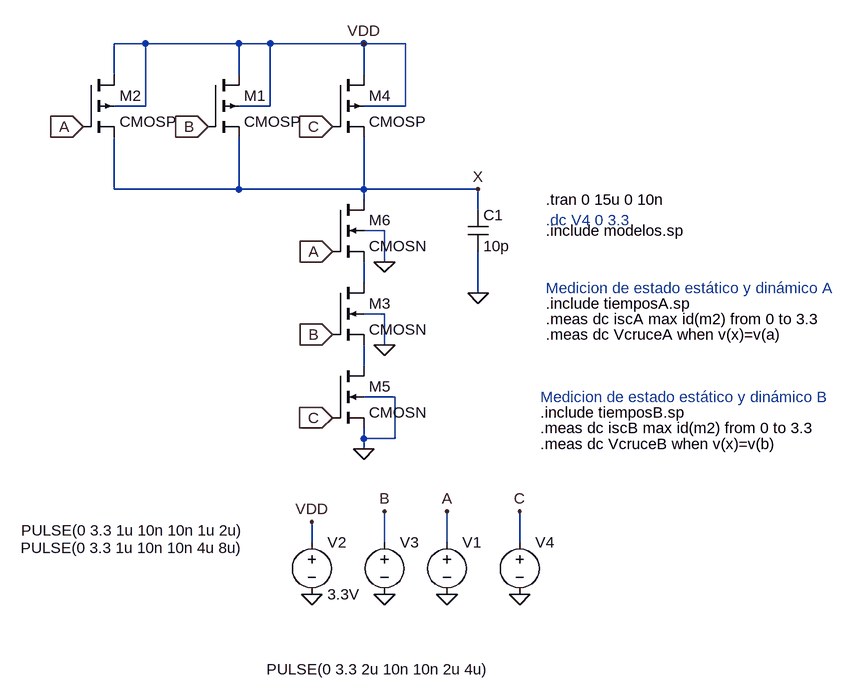
[diagram p0: schematic 3inputs_NAND_1mA.asc]
3inputs_NAND_1mA.asc, the LTspice schematic file:
Version 4
SHEET 1 1484 824
WIRE -176 -400 -224 -400
WIRE -32 -400 -176 -400
WIRE 16 -400 -32 -400
WIRE 160 -400 16 -400
WIRE 224 -400 160 -400
WIRE -224 -352 -224 -400
WIRE -32 -352 -32 -400
WIRE 160 -352 160 -400
WIRE -176 -304 -176 -400
WIRE -176 -304 -224 -304
WIRE 16 -304 16 -400
WIRE 16 -304 -32 -304
WIRE 224 -304 224 -400
WIRE 224 -304 160 -304
WIRE -224 -176 -224 -256
WIRE -32 -176 -32 -256
WIRE -32 -176 -224 -176
WIRE 160 -176 160 -256
WIRE 160 -176 -32 -176
WIRE 336 -176 160 -176
WIRE 160 -160 160 -176
WIRE 336 -144 336 -176
WIRE 192 -112 160 -112
WIRE 192 -64 192 -112
WIRE 160 -32 160 -64
WIRE 336 -16 336 -80
WIRE 192 16 160 16
WIRE 192 64 192 16
WIRE 160 96 160 64
WIRE 208 144 160 144
WIRE 160 208 160 192
WIRE 208 208 208 144
WIRE 208 208 160 208
WIRE 160 224 160 208
WIRE 80 368 80 336
WIRE 192 368 192 320
WIRE 288 368 288 320
WIRE 400 368 400 320
FLAG 80 336 VDD
FLAG 160 -400 VDD
FLAG 288 320 A
FLAG 192 320 B
FLAG 336 -176 X
FLAG 80 448 0
FLAG 192 448 0
FLAG 288 448 0
FLAG 400 320 C
FLAG 400 448 0
FLAG -80 -272 B
IOPIN -80 -272 In
FLAG 112 -272 C
IOPIN 112 -272 In
FLAG -272 -272 A
IOPIN -272 -272 In
FLAG 192 -64 0
FLAG 192 64 0
FLAG 160 224 0
FLAG 336 -16 0
FLAG 112 -80 A
IOPIN 112 -80 In
FLAG 112 48 B
IOPIN 112 48 In
FLAG 112 176 C
IOPIN 112 176 In
SYMBOL voltage 288 352 R0
WINDOW 3 -655 -3 Left 2
WINDOW 123 0 0 Left 0
WINDOW 39 0 0 Left 0
SYMATTR Value PULSE(0 3.3 1u 10n 10n 1u 2u)
SYMATTR InstName V1
SYMBOL voltage 80 352 R0
WINDOW 123 0 0 Left 0
WINDOW 39 0 0 Left 0
SYMATTR InstName V2
SYMATTR Value 3.3V
SYMBOL cap 320 -144 R0
SYMATTR InstName C1
SYMATTR Value 10p
SYMBOL pmos4 112 -352 R0
SYMATTR InstName M4
SYMATTR Value CMOSP
SYMATTR Value2 l=.6u w=4.2u
SYMBOL voltage 192 352 R0
WINDOW 3 -182 211 Left 2
WINDOW 123 0 0 Left 0
WINDOW 39 0 0 Left 0
SYMATTR Value PULSE(0 3.3 2u 10n 10n 2u 4u)
SYMATTR InstName V3
SYMBOL nmos4 112 -160 R0
SYMATTR InstName M6
SYMATTR Value CMOSN
SYMATTR Value2 l=0.6u w=4.2u
SYMBOL voltage 400 352 R0
WINDOW 3 -768 24 Left 2
WINDOW 123 0 0 Left 0
WINDOW 39 0 0 Left 0
SYMATTR Value PULSE(0 3.3 1u 10n 10n 4u 8u)
SYMATTR InstName V4
SYMBOL pmos4 -80 -352 R0
SYMATTR InstName M1
SYMATTR Value CMOSP
SYMATTR Value2 l=.6u w=4.2u
SYMBOL pmos4 -272 -352 R0
SYMATTR InstName M2
SYMATTR Value CMOSP
SYMATTR Value2 l=.6u w=4.2u
SYMBOL nmos4 112 -32 R0
SYMATTR InstName M3
SYMATTR Value CMOSN
SYMATTR Value2 l=0.6u w=4.2u
SYMBOL nmos4 112 96 R0
SYMATTR InstName M5
SYMATTR Value CMOSN
SYMATTR Value2 l=0.6u w=4.2u
TEXT 440 -112 Left 2 !.include modelos.sp
TEXT 440 -160 Left 2 !.tran 0 15u 0 10n
TEXT 440 48 Left 2 !.meas dc VcruceA when v(x)=v(a)
TEXT 440 0 Left 2 !.include tiemposA.sp
TEXT 440 24 Left 2 !.meas dc iscA max id(m2) from 0 to 3.3
TEXT 440 -24 Left 2 ;Medicion de estado estático y dinámico A
TEXT 432 216 Left 2 !.meas dc VcruceB when v(x)=v(b)
TEXT 432 192 Left 2 !.meas dc iscB max id(m2) from 0 to 3.3
TEXT 432 144 Left 2 ;Medicion de estado estático y dinámico B
TEXT 432 168 Left 2 !.include tiemposB.sp
TEXT 440 -128 Left 2 ;.dc V4 0 3.3

The netlist it stands for:
* 3inputs_NAND_1mA.asc
V1 A 0 PULSE(0 3.3 1u 10n 10n 1u 2u)
V2 VDD 0 3.3V
C1 X 0 10p
M4 VDD C X VDD CMOSP l=.6u w=4.2u
V3 B 0 PULSE(0 3.3 2u 10n 10n 2u 4u)
M6 X A N001 0 CMOSN l=0.6u w=4.2u
V4 C 0 PULSE(0 3.3 1u 10n 10n 4u 8u)
M1 VDD B X VDD CMOSP l=.6u w=4.2u
M2 VDD A X VDD CMOSP l=.6u w=4.2u
M3 N001 B N002 0 CMOSN l=0.6u w=4.2u
M5 N002 C 0 0 CMOSN l=0.6u w=4.2u
.model NMOS NMOS
.model PMOS PMOS
.lib standard.mos
.include modelos.sp
.tran 0 15u 0 10n
.meas dc VcruceA when v(x)=v(a)
.include tiemposA.sp
.meas dc iscA max id(m2) from 0 to 3.3
* Medicion de estado estático y dinámico A
.meas dc VcruceB when v(x)=v(b)
.meas dc iscB max id(m2) from 0 to 3.3
* Medicion de estado estático y dinámico B
.include tiemposB.sp
* .dc V4 0 3.3
.backanno
.end

* Results of the author's LTspice run, read from the files saved beside the schematic
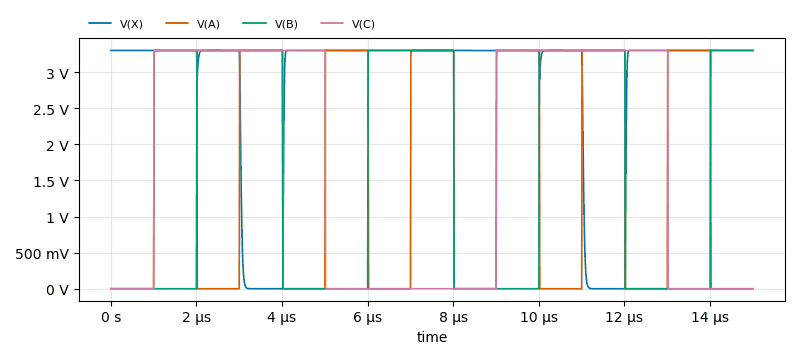
[diagram p1: Transient Analysis of 3inputs_NAND_1mA.asc, plotted from the saved traces]
* Transient Analysis, 1 run:
*   V(X): min -685.7 µV, max 3.301 V, average 2.862 V, rms 3.067 V, last 3.3 V
*   V(A): min 0 V, max 3.3 V, average 1.555 V, rms 2.262 V, last 0 V
*   V(B): min 0 V, max 3.3 V, average 1.545 V, rms 2.257 V, last 3.3 V
*   V(C): min 0 V, max 3.3 V, average 1.764 V, rms 2.412 V, last 0 V